# EAGLE schematic PAD (EAGLE 9.6.0)
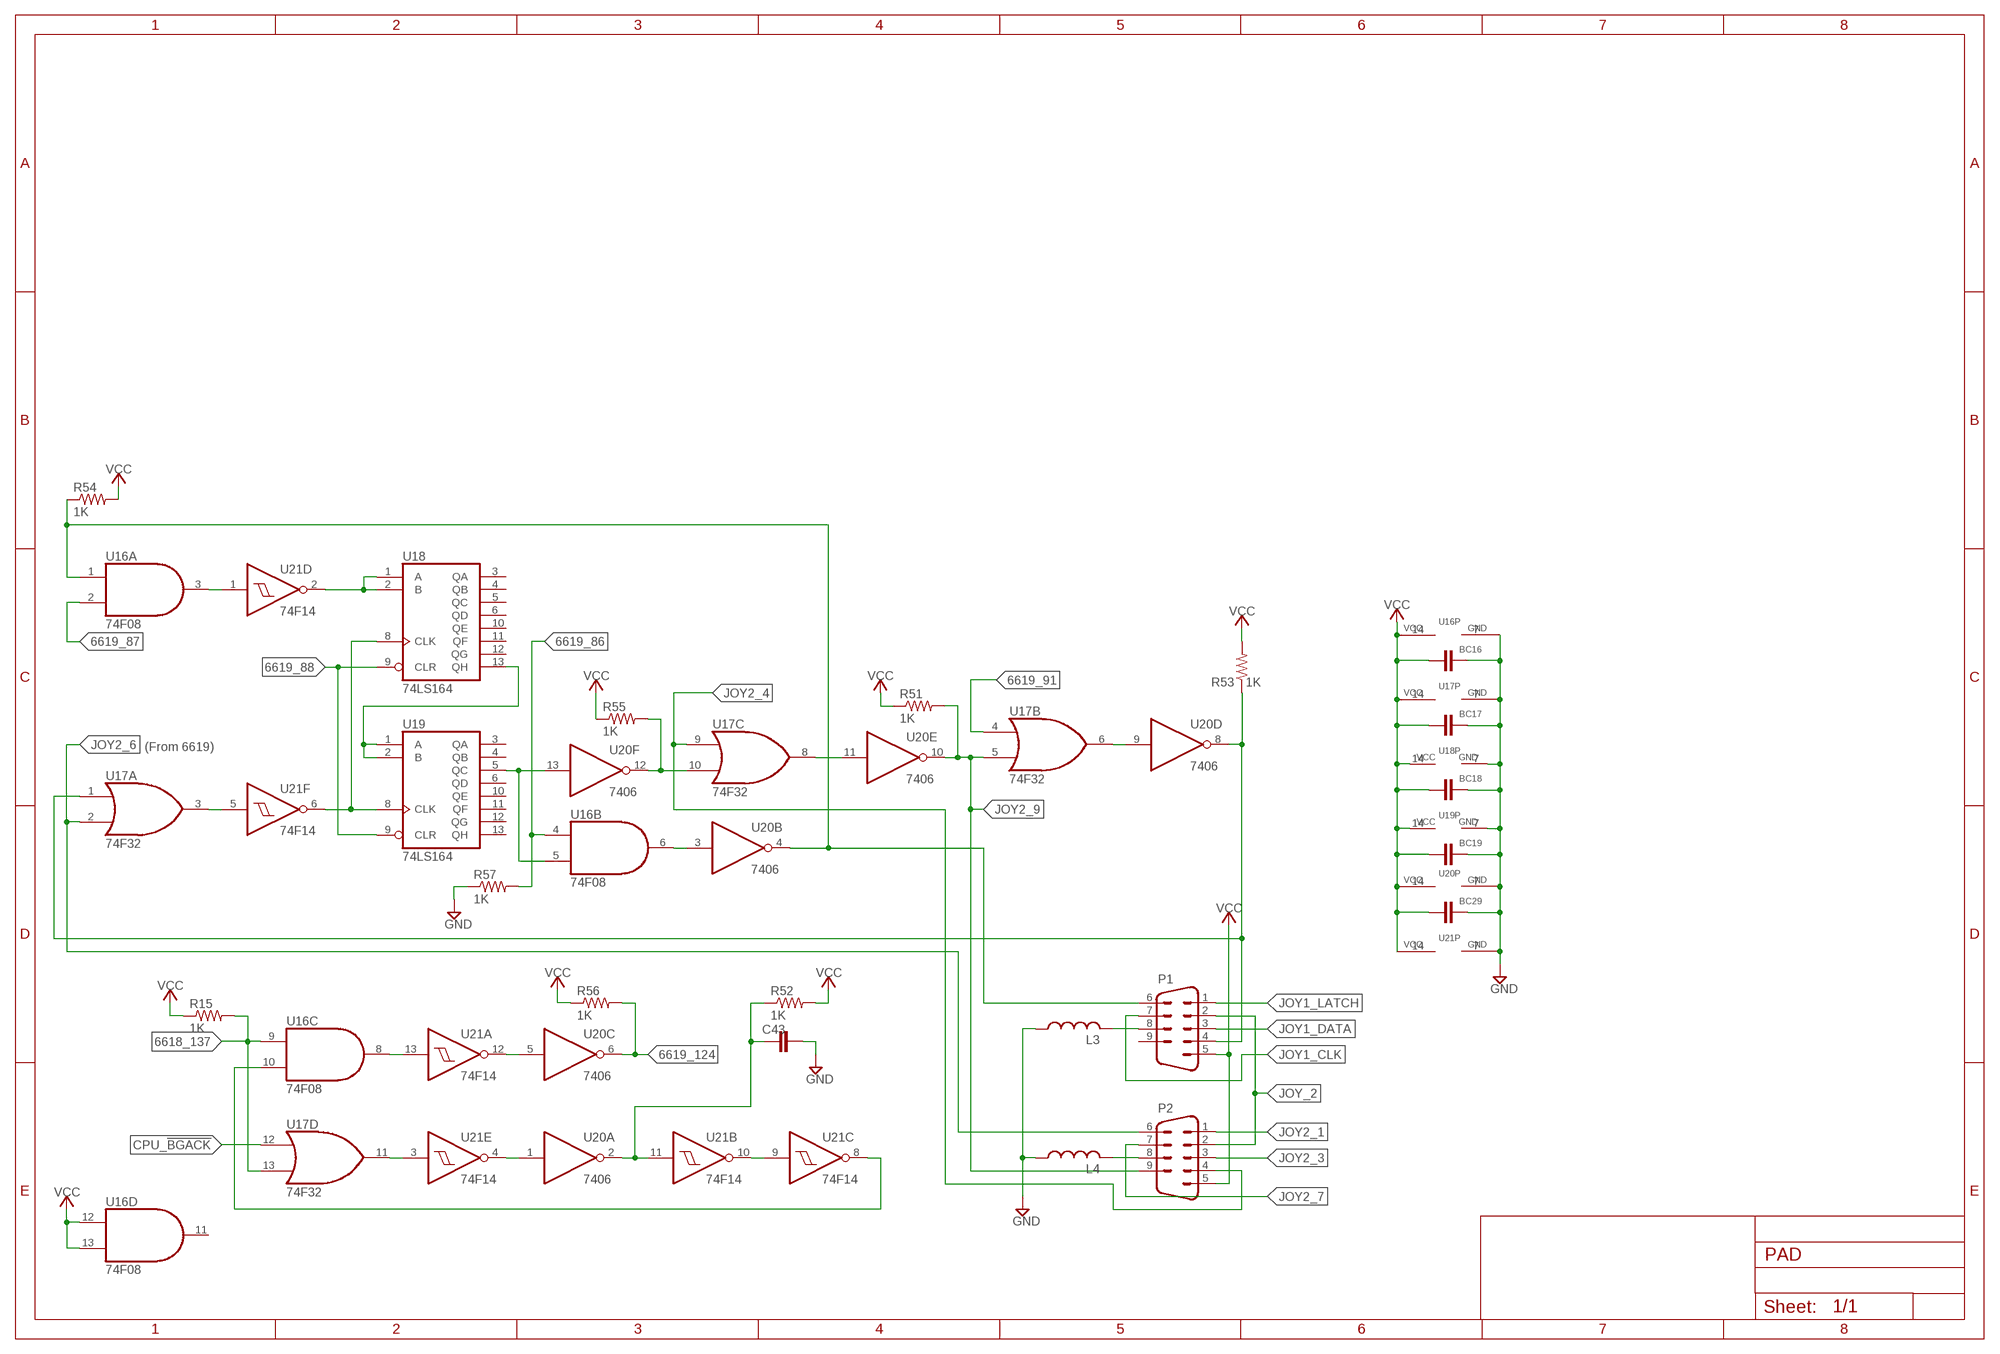
[diagram p0: schematic, sheet 1]

## Parts
BC16  C-EUC0805  [C0805]
BC17  C-EUC0805  [C0805]
BC18  C-EUC0805  [C0805]
BC19  C-EUC0805  [C0805]
BC29  C-EUC0805  [C0805]
C43  C-EUC0805  [C0805]
L3  L-US0204/7  [0204/7]
L4  L-US0204/7  [0204/7]
P1  GAMEPAD_CONNECTOR  [PAD_CONNECTOR]
P2  GAMEPAD_CONNECTOR  [PAD_CONNECTOR]
R15  1K  R-US_R0805  [R0805]
R51  1K  R-US_R0805  [R0805]
R52  1K  R-US_R0805  [R0805]
R53  1K  R-US_R0805  [R0805]
R54  1K  R-US_R0805  [R0805]
R55  1K  R-US_R0805  [R0805]
R56  1K  R-US_R0805  [R0805]
R57  1K  R-US_R0805  [R0805]
U16  74F08  74LS08N  [DIL14]
U17  74F32  74LS32N  [DIL14]
U18  74LS164  74LS164N  [DIL14]
U19  74LS164  74LS164N  [DIL14]
U20  7406  7406N  [DIL14]
U21  74F14  74LS14N  [DIL14]

## Nets
6618_137: R15.2 U16.9(C:I0) U17.13(D:I1)
6619_86: R57.2 U16.4(B:I0)
6619_87: U16.2(A:I1)
6619_88: U18.9(CLR) U19.9(CLR)
6619_91: U17.4(B:I0)
6619_124: R56.2 U20.6(C:O)
CPU_!BGACK: U17.12(D:I0)
GND: BC16.2 BC17.2 BC18.2 BC19.2 BC29.2 C43.2 L3.1 L4.1 R57.1 U16.7(P:GND) U17.7(P:GND) U18.7(GND) U19.7(GND) U20.7(P:GND) U21.7(P:GND)
JOY1_4: P1.4 R53.1 U17.1(A:I0) U20.8(D:O)
JOY1_CLK: P1.7
JOY1_DATA: P1.3
JOY1_LATCH: P1.1
JOY2_1: P2.1
JOY2_3: P2.3
JOY2_4: P2.4 U17.9(C:I0)
JOY2_6: P2.6 U17.2(A:I1)
JOY2_7: P2.7
JOY2_9: P2.9 R51.2 U17.5(B:I1) U20.10(E:O)
JOY_2: P1.2 P2.2
N$1: U18.1(A) U18.2(B) U21.2(D:O)
N$2: U18.13(QH) U19.1(A) U19.2(B)
N$3: U18.8(CLK) U19.8(CLK) U21.6(F:O)
N$4: U17.3(A:O) U21.5(F:I)
N$5: U16.3(A:O) U21.1(D:I)
N$6: U16.5(B:I1) U19.5(QC) U20.13(F:I)
N$7: R55.2 U17.10(C:I1) U20.12(F:O)
N$8: U16.6(B:O) U20.3(B:I)
N$9: U17.8(C:O) U20.11(E:I)
N$10: P1.6 R54.1 U16.1(A:I0) U20.4(B:O)
N$11: L3.2 P1.8(GND)
N$12: U17.6(B:O) U20.9(D:I)
N$13: U16.8(C:O) U21.13(A:I)
N$14: U20.5(C:I) U21.12(A:O)
N$15: L4.2 P2.8(GND)
N$16: U17.11(D:O) U21.3(E:I)
N$17: U20.1(A:I) U21.4(E:O)
N$18: C43.1 R52.1 U20.2(A:O) U21.11(B:I)
N$19: U21.9(C:I) U21.10(B:O)
N$20: U16.10(C:I1) U21.8(C:O)
VCC: BC16.1 BC17.1 BC18.1 BC19.1 BC29.1 P1.5(VCC) P2.5(VCC) R15.1 R51.1 R52.2 R53.2 R54.2 R55.1 R56.1 U16.12(D:I0) U16.13(D:I1) U16.14(P:VCC) U17.14(P:VCC) U18.14(VCC) U19.14(VCC) U20.14(P:VCC) U21.14(P:VCC)
Unconnected: P1.9 U16.11(D:O) U18.3(QA) U18.4(QB) U18.5(QC) U18.6(QD) U18.10(QE) U18.11(QF) U18.12(QG) U19.3(QA) U19.4(QB) U19.6(QD) U19.10(QE) U19.11(QF) U19.12(QG) U19.13(QH)

## Notes on the sheet
- (From 6619)

## Library data of the parts
BC16-BC19 BC29 C43 = rcl:C-EU: CAPACITOR, European symbol; SPICEPREFIX: C
L3 L4 = rcl:L-US: INDUCTOR, American symbol; SPICEPREFIX: L
P1 P2 = acan:GAMEPAD_CONNECTOR: Controller Connector
R15 R51-R57 = rcl:R-US_: RESISTOR, American symbol; SPICEPREFIX: R
U16 = 74xx-us:74*08: Quad 2-input AND gate
U17 = 74xx-us:74*32: Quad 2-input OR gate
U18 U19 = 74xx-eu:74*164: 8-bit parallel out SHIFT REGISTER
U20 = 74xx-us:74*06: Hex INVERTER, open collector high-voltage output
U21 = 74xx-us:74*14: Hex schmitt trigger INVERTER